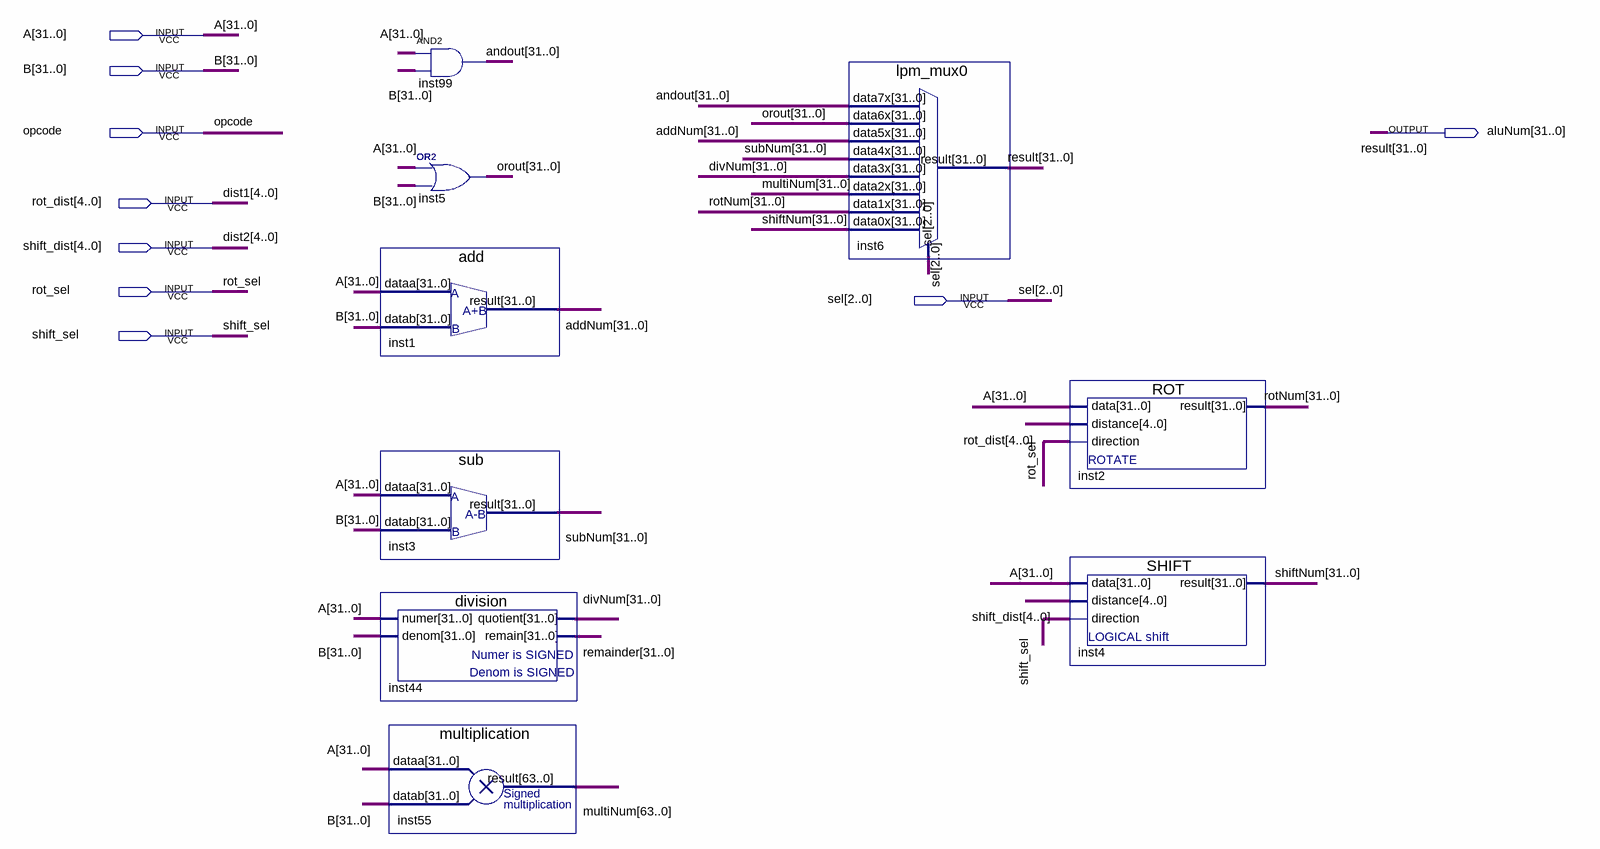
[diagram p0: schematic sheet]
// Quartus schematic ALU.bdf as structural Verilog: 9 symbols, 9 pins
module ALU (
  input  [31:0] A,
  input  [31:0] B,
  input  opcode,
  input  [4:0] rot_dist,
  input  [4:0] shift_dist,
  input  rot_sel,
  input  [2:0] sel,
  input  shift_sel,
  output [31:0] aluNum
);

  wire [31:0] addNum, andout, divNum, orout, remainder, rotNum, shiftNum, subNum;
  wire [63:0] multiNum;

  assign andout = A & B;  // AND2 inst99, 32 bits wide
  assign orout = A | B;  // OR2 inst5, 32 bits wide
  add inst1 (.dataa(A), .datab(B), .result(addNum));
  sub inst3 (.dataa(A), .datab(B), .result(subNum));
  division inst44 (.numer(A), .denom(B), .quotient(divNum), .remain(remainder));
  multiplication inst55 (.dataa(A), .datab(B), .result(multiNum));
  lpm_mux0 inst6 (
    .data7x(andout), .data6x(orout), .data5x(addNum), .data4x(subNum), .data3x(divNum),
    .data2x(multiNum[31:0]), .data1x(rotNum), .data0x(shiftNum), .sel(sel), .result(aluNum));
  ROT inst2 (.data(A), .distance(rot_dist), .direction(rot_sel), .result(rotNum));
  SHIFT inst4 (.data(A), .distance(shift_dist), .direction(shift_sel), .result(shiftNum));

  // Other names for the same wires on the sheet: dist1[4:0] = rot_dist; dist2[4:0] = shift_dist;
  //   result[31:0] = aluNum
endmodule
